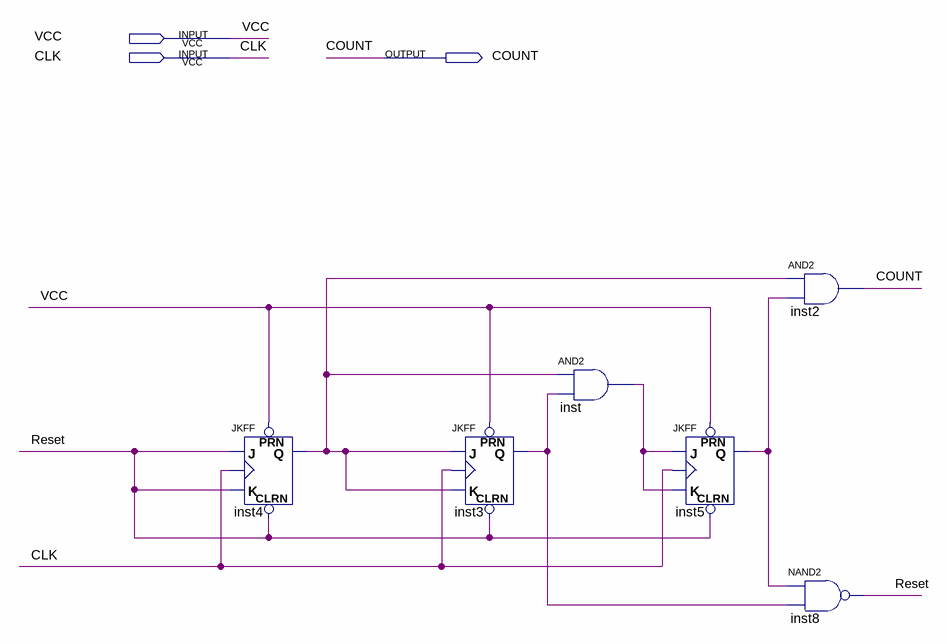
[diagram p0: schematic sheet]
// Quartus schematic Reloj5.bdf as structural Verilog: 6 symbols, 3 pins
module Reloj5 (
  input  VCC,
  input  CLK,
  output COUNT
);

  wire inst3_q, inst4_q, inst5_q, inst_out, Reset;

  JKFF inst4 (.PRN(VCC), .CLRN(Reset), .K(Reset), .J(Reset), .CLK(CLK), .Q(inst4_q));
  JKFF inst3 (.PRN(VCC), .CLRN(Reset), .K(inst4_q), .J(inst4_q), .CLK(CLK), .Q(inst3_q));
  and inst (inst_out, inst4_q, inst3_q);
  JKFF inst5 (.PRN(VCC), .CLRN(Reset), .K(inst_out), .J(inst_out), .CLK(CLK), .Q(inst5_q));
  and inst2 (COUNT, inst4_q, inst5_q);
  nand inst8 (Reset, inst5_q, inst3_q);
endmodule
